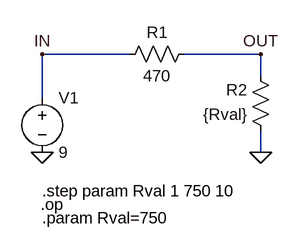
[diagram p0: schematic Draft7.asc]
Draft7.asc, the LTspice schematic file:
Version 4
SHEET 1 880 680
WIRE 128 80 0 80
WIRE 320 80 208 80
WIRE 320 112 320 80
WIRE 0 144 0 80
WIRE 320 224 320 192
FLAG 0 224 0
FLAG 320 224 0
FLAG 0 80 IN
FLAG 320 80 OUT
SYMBOL voltage 0 128 R0
WINDOW 123 0 0 Left 0
WINDOW 39 0 0 Left 0
SYMATTR InstName V1
SYMATTR Value 9
SYMBOL res 224 64 R90
WINDOW 0 0 56 VBottom 2
WINDOW 3 32 56 VTop 2
SYMATTR InstName R1
SYMATTR Value 470
SYMBOL res 336 208 R180
WINDOW 0 36 76 Left 2
WINDOW 3 36 40 Left 2
SYMATTR InstName R2
SYMATTR Value {Rval}
TEXT 0 280 Left 2 !.step param Rval 1 750 10
TEXT 0 320 Left 2 !.param Rval=750
TEXT -2 300 Left 2 !.op

The netlist it stands for:
* Draft7.asc
V1 IN 0 9
R1 OUT IN 470
R2 0 OUT {Rval}
.step param Rval 1 750 10
.param Rval=750
.op
.backanno
.end